# Altium schematic sheet AUDIO.SchDoc: AUDIO
size A4; Project: STM32MP15-DISCO PI; Date: Not used; ApprovedBy: Not used; CheckedBy: Not used; Author: Not used; CompanyName: STMicroelectronics; DrawnBy: Not used; Engineer: Not used; Organization: Not used; Address1: Not used; Address2: Not used; Address3: Not used; Address4: Not used; DocumentNumber: 6; Revision: Not used; SheetNumber: 7; SheetTotal: 15; CurrentTime: Not used; CurrentDate: Not used; Time: Not used; DocumentFullPathAndName: Not used; DocumentName: Not used; ModifiedDate: Not used; ImagePath: Not used; ProjectName: Not used; Application_BuildNumber: Not used
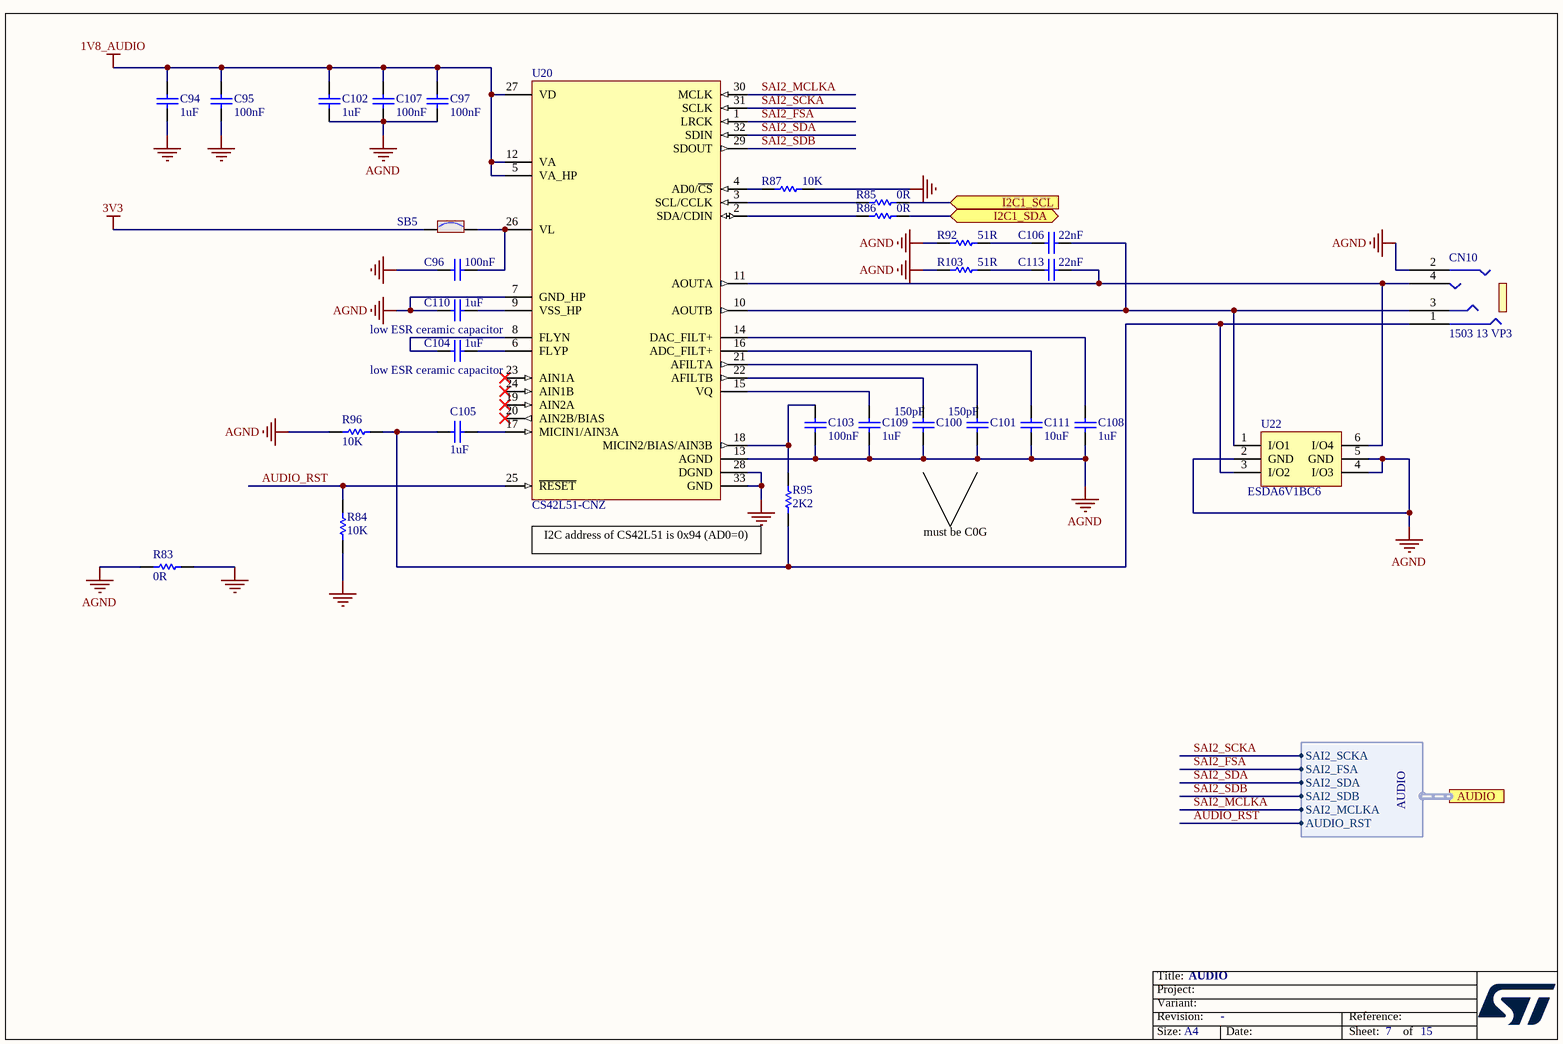
[diagram p0: AUDIO.SchDoc]

## Parts
C94  value 1uF  [C0402]
C95  value 100nF  [C0402]
C96  value 100nF  [C0402]
C97  value 100nF  [C0402]
C100  value 150pF  [C0603]
C101  value 150pF  [C0603]
C102  value 1uF  [C0402]
C103  value 100nF  [C0402]
C104  value 1uF  [C0603]
C105  value 1uF  [C0402]
C106  value 22nF  [C0402]
C107  value 100nF  [C0402]
C108  value 1uF  [C0402]
C109  value 1uF  [C0402]
C110  value 1uF  [C0603]
C111  value 10uF  [C0603]
C113  value 22nF  [C0402]
CN10  value 1503 13 VP3  [CON_JACK-3P5-SMT_LUMBERG_1503-13-VP3]
R83  value 0R  [R0603]
R84  value 10K  [R0402]
R85  value 0R  [R0402]
R86  value 0R  [R0402]
R87  value 10K  [R0402]
R92  value 51R  [R0402]
R95  value 2K2  [R0402]
R96  value 10K  [R0402]
R103  value 51R  [R0402]
SB5  (no value)  [SOLDER-BRIDGE_R0603-0R]
U20  value CS42L51-CNZ  [ICC_QFN32-EPAD_5X5_P050]
U22  value ESDA6V1BC6  [ESD_SOT23-6L]

## Ports
AUDIO (harness AUDIO), I2C1_SCL (in), I2C1_SDA (bidir)

## Harnesses
AUDIO: SAI2_SCKA, SAI2_FSA, SAI2_SDA, SAI2_SDB, SAI2_MCLKA, AUDIO_RST

## Nets
1V8_AUDIO: C94.2 C95.2 C97.2 C102.2 C107.2 U20.5(VA_HP) U20.12(VA) U20.27(VD)
3V3: SB5.1
AGND: C97.1 C100.1 C101.1 C102.1 C103.1 C107.1 C108.1 C109.1 C110.1 C111.1 CN10.2 R83.1 R92.1 R96.1 R103.1 U20.7(GND_HP) U20.13(AGND) U22.2(GND) U22.4(I/O3) U22.5(GND)
GND: C94.1 C95.1 C96.2 R83.2 R84.1 R87.2 U20.28(DGND) U20.33(GND)
AUDIO_RST: R84.2 U20.25(~{RESET}) ; port AUDIO.AUDIO_RST
I2C1_SCL: R85.2 ; port I2C1_SCL
I2C1_SDA: R86.2 ; port I2C1_SDA
SAI2_FSA: U20.1(LRCK) ; port AUDIO.SAI2_FSA
SAI2_MCLKA: U20.30(MCLK) ; port AUDIO.SAI2_MCLKA
SAI2_SCKA: U20.31(SCLK) ; port AUDIO.SAI2_SCKA
SAI2_SDA: U20.32(SDIN) ; port AUDIO.SAI2_SDA
SAI2_SDB: U20.29(SDOUT) ; port AUDIO.SAI2_SDB
NetC96_1: C96.1 SB5.2 U20.26(VL)
NetC100_2: C100.2 U20.22(AFILTB)
NetC101_2: C101.2 U20.21(AFILTA)
NetC103_2: C103.2 R95.2 U20.18(MICIN2/BIAS/AIN3B)
NetC104_1: C104.1 U20.8(FLYN)
NetC104_2: C104.2 U20.6(FLYP)
NetC105_1: C105.1 CN10.1 R95.1 R96.2 U22.3(I/O2)
NetC105_2: C105.2 U20.17(MICIN1/AIN3A)
NetC106_1: C106.1 R92.2
NetC106_2: C106.2 CN10.3 U20.10(AOUTB) U22.1(I/O1)
NetC108_2: C108.2 U20.14(DAC_FILT+)
NetC109_2: C109.2 U20.15(VQ)
NetC110_2: C110.2 U20.9(VSS_HP)
NetC111_2: C111.2 U20.16(ADC_FILT+)
NetC113_1: C113.1 R103.2
NetC113_2: C113.2 CN10.4 U20.11(AOUTA) U22.6(I/O4)
NetR85_1: R85.1 U20.3(SCL/CCLK)
NetR86_1: R86.1 U20.2(SDA/CDIN)
NetR87_1: R87.1 U20.4(AD0/~{CS})

Not connected (* = marked no-connect by the designer): U20 19(AIN2A)* 20(AIN2B/BIAS)* 23(AIN1A)* 24(AIN1B)*

## Notes on the sheet
- low ESR ceramic capacitor
- I2C address of CS42L51 is 0x94 (AD0=0)
- must be C0G
- Title:
- Project:
- Size:
- Revision:
- Variant:
- A4
- -
- Date:
- Reference:
- Sheet:
- of

## Library data of the parts
C94 C102 C105 C108 C109 = MCD-00095: Capacitor,1uF,6V3,X5R,10%,0402; Manufacturer_Part_Number: GRM155R61E105KA12; Manufacturer: MURATA; Alternate_Manufacturer_Part_Number: GRM155R60J105KE19; ECCN_US: EAR99; ECCN_EU: NEC; Provided_By: SUBCO; Initial_Board_Reference: mb1262; Internal_Part_Number: MCD-00095; ComponentLink1Description: Datasheet; Status: Released; Part_Type: Capacitor; Package: C0402; ComponentLink1URL: http://tunmcdsvn.tun.st.com/Component_Datasheet_Library/Trunk/Capacitors/Murata_Capacitor_GR_series; Alternate_Manufacturer: MURATA
C95-C97 C103 C107 = MCD-00006: Capacitor,100nF,16V,X7R,10%,0402; Manufacturer_Part_Number: CC0402KRX7R7BB104; Manufacturer: YAGEO; Alternate_Manufacturer: MURATA; Alternate_Manufacturer_Part_Number: GCM155R71C104KA55D; Provided_By: SUBCO; Initial_Board_Reference: mb1274; Internal_Part_Number: MCD-00006; ComponentLink1Description: Datasheet; ECCN_US: n/a; ECCN_EU: n/a; Status: Released; Part_Type: Capacitor; Package: C0402; ComponentLink1URL: http://tunmcdsvn.tun.st.com/Component_Datasheet_Library/Trunk/Capacitors/Yageo_Multilayer_Capacitor_X7R_series_100pF_to_22uF
C100 C101 = MCD-00304: Capacitor,150pF,50V,COG,5%,0603; Manufacturer_Part_Number: CC0603JRNPO9BN151; Manufacturer: YAGEO; Provided_By: SUBCO; Initial_Board_Reference: mb1263; Internal_Part_Number: MCD-00304; ComponentLink1Description: Datasheet; ECCN_US: n/a; ECCN_EU: n/a; Status: Released; Part_Type: Capacitor; Package: C0603; ComponentLink1URL: http://tunmcdsvn.tun.st.com/Component_Datasheet_Library/Trunk/Capacitors/Yageo_Capacitor_NP0_16V-to-50V
C104 C110 = MCD-00010: Capacitor,1uF,16V,X5R,10%,0603; Manufacturer_Part_Number: CC0603KRX5R7BB105; Manufacturer: YAGEO; Provided_By: SUBCO; Initial_Board_Reference: mb1274; Internal_Part_Number: MCD-00010; ComponentLink1Description: Datasheet; ECCN_US: n/a; ECCN_EU: n/a; Status: Released; Part_Type: Capacitor; Package: C0603; ComponentLink1URL: http://tunmcdsvn.tun.st.com/Component_Datasheet_Library/Trunk/Capacitors/Yageo_Multilayer_capacitor_X5R_series_100pF_to_100uF
C106 C113 = MCD-00202: Capacitor,22nF,16V,X7R,10%,0402; Manufacturer_Part_Number: CC0402KRX7R7BB223; Manufacturer: YAGEO; Provided_By: SUBCO; Internal_Part_Number: MCD-00202; Status: Checked; Part_Type: Capacitor; Package: C0402; ComponentLink1Description: Datasheet; ComponentLink1URL: http://tunmcdsvn.tun.st.com/Component_Datasheet_Library/Trunk/Capacitors/Yageo_Multilayer_Capacitor_X7R_series_100pF_to_22uF
C111 = MCD-00098: Capacitor,10uF,6V3,X5R,10%,0603; Manufacturer_Part_Number: CC0603KRX5R5BB106; Manufacturer: YAGEO; Provided_By: SUBCO; Initial_Board_Reference: mb1262; Internal_Part_Number: MCD-00098; ComponentLink1Description: Datasheet; Status: Released; Part_Type: Capacitor; Package: C0603; ECCN_US: n/a; ECCN_EU: n/a; ComponentLink1URL: http://tunmcdsvn.tun.st.com/Component_Datasheet_Library/Trunk/Capacitors/Yageo_Multilayer_capacitor_X5R_series_100pF_to_100uF
CN10 = MCD-00270: Connector Jack socket Stereo 3.5mm, 4 pins, RA, SMT, Black; Manufacturer: LUMBERG; Alternate_Manufacturer: FARNELL; Alternate_Manufacturer_Part_Number: 1368640; Provided_By: SUBCO; Initial_Board_Reference: MB1272; Internal_Part_Number: MCD-00270; Manufacturer_Part_Number: 1503 13 VP3; ComponentLink1Description: Datasheet; ComponentLink1URL: http://tunmcdsvn.tun.st.com/Component_Datasheet_Library/Trunk/Connectors/Lumberg_150313_Jack Connectors; Status: Checked; Part_Type: Connector
R83 = MCD-00056: Resistor,0R,0603,5%,1/10W; Manufacturer_Part_Number: RC0603JR-070RL; Manufacturer: YAGEO; Provided_By: SUBCO; Initial_Board_Reference: mb1274; Internal_Part_Number: MCD-00056; ComponentLink1Description: Datasheet; ECCN_US: n/a; ECCN_EU: n/a; Status: Released; Part_Type: Resistor; ComponentLink1URL: http://tunmcdsvn.tun.st.com/Component_Datasheet_Library/Trunk/Resistors/Yageo_Resistor_RC0603-series; Package: R0603
R84 R87 R96 = MCD-00053: Resistor,10K,0402,1%,1/16W; Manufacturer_Part_Number: RC0402FR-0710KL; Manufacturer: YAGEO; Provided_By: SUBCO; Initial_Board_Reference: mb1274; Internal_Part_Number: MCD-00053; ComponentLink1Description: Datasheet; ECCN_US: n/a; ECCN_EU: n/a; Status: Released; Part_Type: Resistor; ComponentLink1URL: http://tunmcdsvn.tun.st.com/Component_Datasheet_Library/Trunk/Resistors/Yageo_Resistor_RC0402-series; Package: R0402
R85 R86 = MCD-00052: Resistor,0R,0402,5%,1/16W; Manufacturer_Part_Number: RC0402JR-070RL; Manufacturer: YAGEO; Provided_By: SUBCO; Initial_Board_Reference: mb1274; Internal_Part_Number: MCD-00052; ComponentLink1Description: Datasheet; ECCN_US: n/a; ECCN_EU: n/a; Status: Released; Part_Type: Resistor; ComponentLink1URL: http://tunmcdsvn.tun.st.com/Component_Datasheet_Library/Trunk/Resistors/Yageo_Resistor_RC0402-series; Package: R0402
R92 R103 = MCD-00485: Resistor,51R,0402,1%,1/16W; Manufacturer_Part_Number: RC0402FR-0751RL; Manufacturer: YAGEO; Provided_By: SUBCO; Internal_Part_Number: MCD-00485; ComponentLink1Description: Datasheet; ECCN_US: n/a; ECCN_EU: n/a; Status: Released; Part_Type: Resistor; ComponentLink1URL: http://tunmcdsvn.tun.st.com/Component_Datasheet_Library/Trunk/Resistors/Yageo_Resistor_RC0402-series; Package: R0402
R95 = MCD-00057: Resistor,2K2,0402,1%,1/16W; Manufacturer_Part_Number: RC0402FR-072K2L; Manufacturer: YAGEO; Provided_By: SUBCO; Initial_Board_Reference: mb1274; Internal_Part_Number: MCD-00057; ComponentLink1Description: Datasheet; ECCN_US: n/a; ECCN_EU: n/a; Status: Released; Part_Type: Resistor; ComponentLink1URL: http://tunmcdsvn.tun.st.com/Component_Datasheet_Library/Trunk/Resistors/Yageo_Resistor_RC0402-series; Package: R0402
SB5 = MCD-00071: Solder Bridge ON; Part_Type: Mechanical; Manufacturer: YAGEO; Manufacturer_Part_Number: RC0603JR-070RL; Provided_By: SUBCO; Initial_Board_Reference: mb1274; Internal_Part_Number: MCD-00071; ECCN_US: n/a; ECCN_EU: n/a; Status: Released; ComponentLink1Description: Datasheet; ComponentLink1URL: http://tunmcdsvn.tun.st.com/Component_Datasheet_Library/Trunk/Resistors/Yageo_Resistor_RC0603-series; Package: SB0603
U20 = MCD-00265: Low-Power, Stereo Codec with Headphone Amp; Manufacturer: CIRRUS LOGIC; Part_Type: IC; Provided_By: SUBCO; ECCN_US: EAR99; ECCN_EU: NEC; Initial_Board_Reference: MB1272; Internal_Part_Number: MCD-00265; Manufacturer_Part_Number: CS42L51-CNZ; ComponentLink1Description: Datasheet; ComponentLink1URL: http://tunmcdsvn.tun.st.com/Component_Datasheet_Library/Trunk/IC/Cirrus Logic_CS42L51; Status: Released
U22 = MCD-00247: Quad Bidir ESD protection; Manufacturer: STMICROELECTRONICS; Part_Type: Diode; BMS_Part_Number: 9179038; Provided_By: SUBCO with ST control; ECCN_US: EAR99; ECCN_EU: NEC; Initial_Board_Reference: MB1311; Internal_Part_Number: MCD-00247; Manufacturer_Part_Number: ESDA6V1BC6; ComponentLink1Description: Datasheet; Status: Released; ComponentLink1URL: http://tunmcdsvn.tun.st.com/Component_Datasheet_Library/Trunk/Diodes/STM_ESD_ESDA6V1BC6